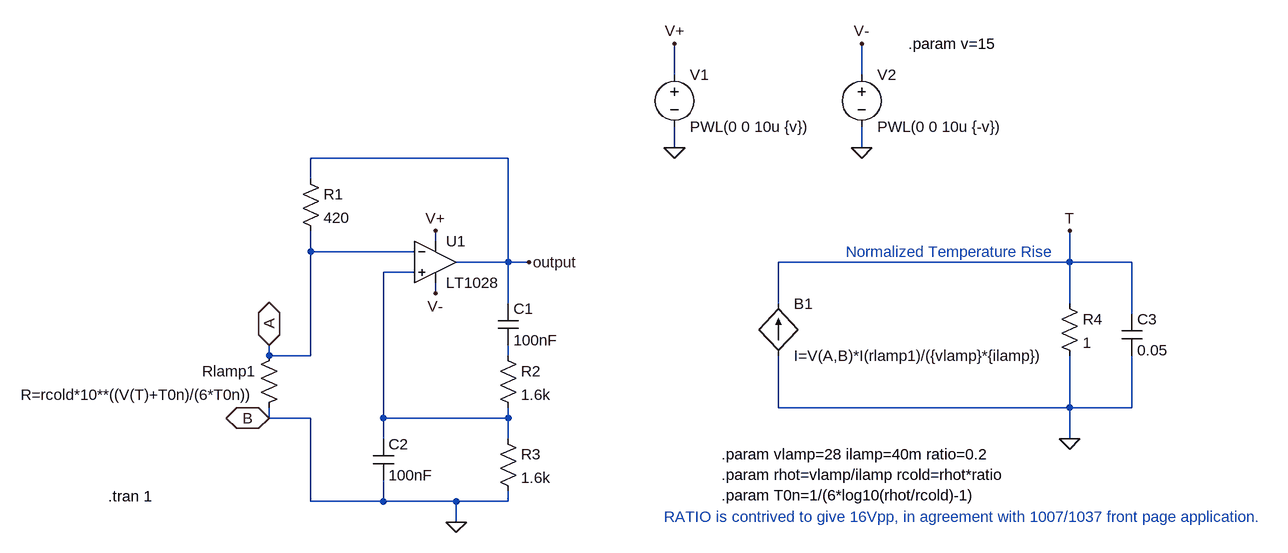
[diagram p0: schematic wien bridge oscillator_combined bulb.asc]
wien bridge oscillator_combined bulb.asc, the LTspice schematic file:
Version 4
SHEET 1 1952 720
WIRE 592 -208 592 -256
WIRE 880 -208 880 -256
WIRE 592 -96 592 -128
WIRE 880 -96 880 -128
WIRE 336 -80 32 -80
WIRE 32 -48 32 -80
WIRE 224 48 224 32
WIRE 32 64 32 32
WIRE 192 64 32 64
WIRE 336 80 336 -80
WIRE 336 80 256 80
WIRE 368 80 336 80
WIRE 1200 80 1200 32
WIRE 1200 80 752 80
WIRE 1296 80 1200 80
WIRE 192 96 144 96
WIRE 224 128 224 112
WIRE 336 144 336 80
WIRE 752 144 752 80
WIRE 1200 144 1200 80
WIRE 1296 160 1296 80
WIRE -32 224 -32 208
WIRE 32 224 32 64
WIRE 32 224 -32 224
WIRE 336 224 336 208
WIRE 752 304 752 224
WIRE 1200 304 1200 224
WIRE 1200 304 752 304
WIRE 1296 304 1296 224
WIRE 1296 304 1200 304
WIRE -32 320 -32 304
WIRE 32 320 -32 320
WIRE 144 320 144 96
WIRE 336 320 336 304
WIRE 336 320 144 320
WIRE 144 352 144 320
WIRE 336 352 336 320
WIRE 1200 352 1200 304
WIRE 32 448 32 320
WIRE 144 448 144 416
WIRE 144 448 32 448
WIRE 256 448 144 448
WIRE 336 448 336 432
WIRE 336 448 256 448
WIRE 256 480 256 448
FLAG 592 -96 0
FLAG 880 -96 0
FLAG 592 -256 V+
FLAG 880 -256 V-
FLAG 224 32 V+
FLAG 224 128 V-
FLAG 256 480 0
FLAG 368 80 output
FLAG 1200 32 T
FLAG -32 208 A
IOPIN -32 208 BiDir
FLAG -32 320 B
IOPIN -32 320 BiDir
FLAG 1200 352 0
SYMBOL res 16 -64 R0
SYMATTR InstName R1
SYMATTR Value 420
SYMBOL res 320 208 R0
SYMATTR InstName R2
SYMATTR Value 1.6k
SYMBOL res 320 336 R0
SYMATTR InstName R3
SYMATTR Value 1.6k
SYMBOL cap 320 144 R0
SYMATTR InstName C1
SYMATTR Value 100nF
SYMBOL cap 128 352 R0
SYMATTR InstName C2
SYMATTR Value 100nF
SYMBOL voltage 592 -224 R0
WINDOW 123 0 0 Left 2
WINDOW 39 0 0 Left 2
SYMATTR InstName V1
SYMATTR Value PWL(0 0 10u {v})
SYMBOL voltage 880 -224 R0
WINDOW 123 0 0 Left 2
WINDOW 39 0 0 Left 2
SYMATTR InstName V2
SYMATTR Value PWL(0 0 10u {-v})
SYMBOL bi2 752 144 R0
SYMATTR InstName B1
SYMATTR Value I=V(A,B)*I(rlamp1)/({vlamp}*{ilamp})
SYMBOL res 1184 128 R0
SYMATTR InstName R4
SYMATTR Value 1
SYMBOL cap 1280 160 R0
SYMATTR InstName C3
SYMATTR Value 0.05
SYMBOL res -16 208 M0
SYMATTR InstName Rlamp1
SYMATTR Value R=rcold*10**((V(T)+T0n)/(6*T0n))
SYMBOL Opamps\\LT1028 224 16 R0
SYMATTR InstName U1
TEXT -280 440 Left 2 !.tran 1
TEXT 952 -256 Left 2 !.param v=15
TEXT 664 376 Left 2 !.param vlamp=28 ilamp=40m ratio=0.2\n.param rhot=vlamp/ilamp rcold=rhot*ratio\n.param T0n=1/(6*log10(rhot/rcold)-1)
TEXT 576 472 Left 2 ;RATIO is contrived to give 16Vpp, in agreement with 1007/1037 front page application.
TEXT 856 64 Left 2 ;Normalized Temperature Rise

The netlist it stands for:
* wien bridge oscillator_combined bulb.asc
R1 output A 420
R2 N002 N001 1.6k
R3 N001 0 1.6k
C1 output N002 100nF
C2 N001 0 100nF
V1 V+ 0 PWL(0 0 10u {v})
V2 V- 0 PWL(0 0 10u {-v})
B1 0 T I=V(A,B)*I(rlamp1)/({vlamp}*{ilamp})
R4 T 0 1
C3 T 0 0.05
Rlamp1 A 0 R=rcold*10**((V(T)+T0n)/(6*T0n))
XU1 N001 A V+ V- output LT1028  ; pins In+ In- V+ V- OUT
.tran 1
.param v=15
.param vlamp=28 ilamp=40m ratio=0.2
.param rhot=vlamp/ilamp rcold=rhot*ratio
.param T0n=1/(6*log10(rhot/rcold)-1)
* RATIO is contrived to give 16Vpp, in agreement with 1007/1037 front page application.
* Normalized Temperature Rise
.lib LTC.lib
.backanno
.end